# Altium project Pedal_XLR.PrjPcb (part 1 of 2)
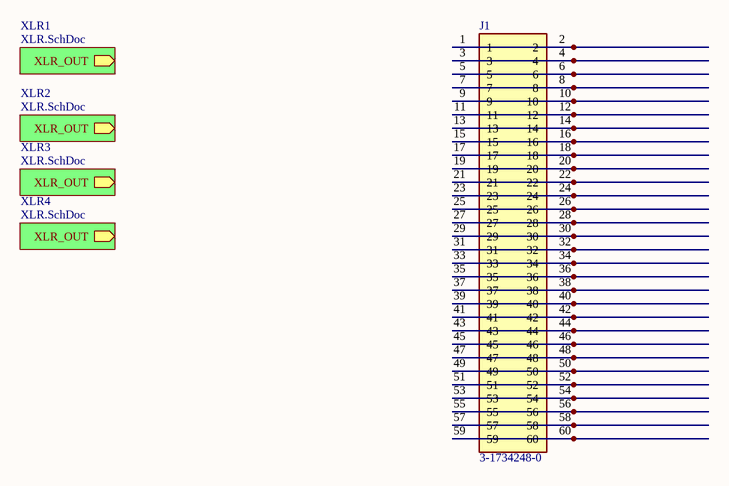
[diagram p0: Pedal_XLR.SchDoc]
3 sheets, 328 parts. Net scope: hierarchical (ports join the sheet entries above them; power ports are global).
Board file: Pedal_XLR.PcbDoc
Sheets:
  Pedal_XLR.SchDoc
    XLR1 = XLR.SchDoc
    XLR2 = XLR.SchDoc
    XLR3 = XLR.SchDoc
    XLR4 = XLR.SchDoc
  analog_tmp.SchDoc

## Sheet Pedal_XLR.SchDoc
size A3; SheetNumber: 1; SheetTotal: 3

### Parts
J1  3-1734248-0  [317342480]

### Sub-sheets
XLR1 = XLR.SchDoc: XLR_OUT (out)
XLR2 = XLR.SchDoc: XLR_OUT (out)
XLR3 = XLR.SchDoc: XLR_OUT (out)
XLR4 = XLR.SchDoc: XLR_OUT (out)

### Nets
NetJ1_1: J1.1 J1.2
NetJ1_3: J1.3 J1.4
NetJ1_5: J1.5 J1.6
NetJ1_7: J1.7 J1.8
NetJ1_9: J1.9 J1.10
NetJ1_11: J1.11 J1.12
NetJ1_13: J1.13 J1.14
NetJ1_15: J1.15 J1.16
NetJ1_17: J1.17 J1.18
NetJ1_19: J1.19 J1.20
NetJ1_21: J1.21 J1.22
NetJ1_23: J1.23 J1.24
NetJ1_25: J1.25 J1.26
NetJ1_27: J1.27 J1.28
NetJ1_29: J1.29 J1.30
NetJ1_31: J1.31 J1.32
NetJ1_33: J1.33 J1.34
NetJ1_35: J1.35 J1.36
NetJ1_37: J1.37 J1.38
NetJ1_39: J1.39 J1.40
NetJ1_41: J1.41 J1.42
NetJ1_43: J1.43 J1.44
NetJ1_45: J1.45 J1.46
NetJ1_47: J1.47 J1.48
NetJ1_49: J1.49 J1.50
NetJ1_51: J1.51 J1.52
NetJ1_53: J1.53 J1.54
NetJ1_55: J1.55 J1.56
NetJ1_57: J1.57 J1.58
NetJ1_59: J1.59 J1.60

### Library data of the parts
J1 = 3-1734248-0: Connector; Manufacturer_Name: TE Connectivity; Datasheet Link: https://www.te.com/commerce/DocumentDelivery/DDEController?Action=srchrtrv&DocNm=5-1773461-0_Standard_FPC_Connectors_QRG&DocType=Data%20Sheet&DocLang=English&PartCntxt=3-1734248-0&DocFormat=pdf; Height: 7.7mm; Manufacturer_Part_Number: 3-1734248-0; Mouser Part Number: 571-3-1734248-0; Mouser Price/Stock: https://www.mouser.co.uk/ProductDetail/TE-Connectivity/3-1734248-0?qs=rVE9j%252BL6g1a4TQRjUuGYiA%3D%3D; Arrow Part Number: 3-1734248-0; Arrow Price/Stock: https://www.arrow.com/en/products/3-1734248-0/te-connectivity; System: Connector

## Sheet XLR.SchDoc
size A4; SheetNumber: 2; SheetTotal: 3
Used 4 times, as channels XLR1, XLR2, XLR3, XLR4. Parts and nets are listed once, with the designators drawn on the sheet.
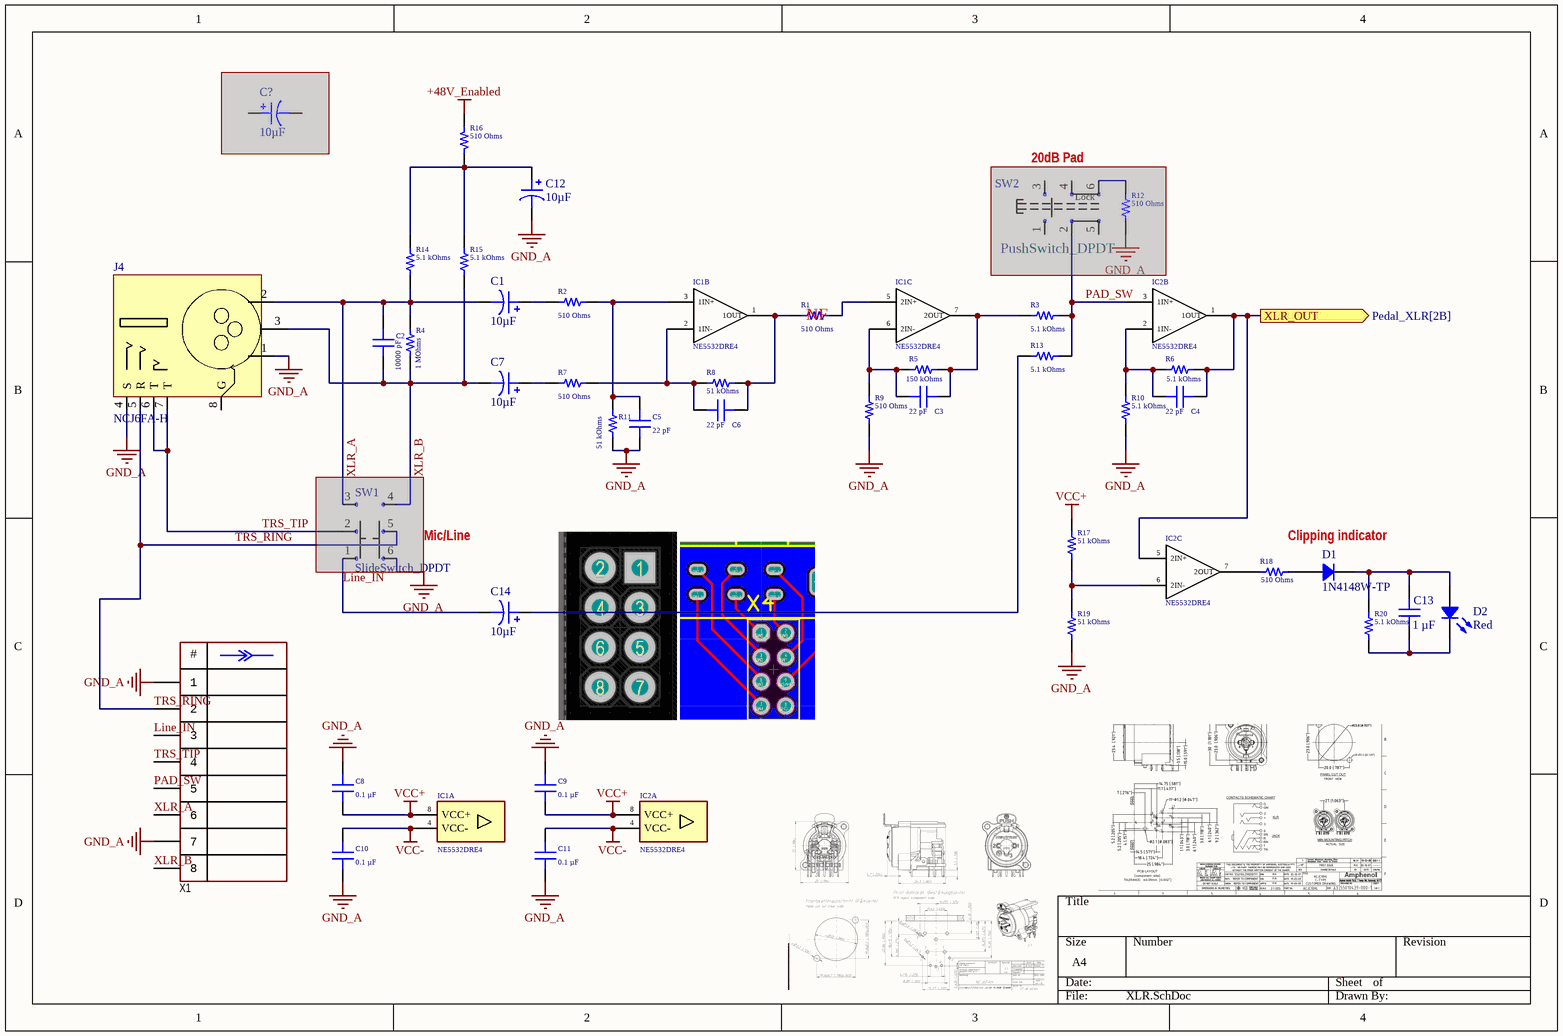
[diagram p1: XLR.SchDoc]

### Parts
C1  10µF  [CAP POL 1206_3216]
C2  10000 pF  [MURATA GRM188 0603_1608]
C3  22 pF  [CAP 0603_1608]
C4  22 pF  [CAP 0603_1608]
C5  22 pF  [CAP 0603_1608]
C6  22 pF  [CAP 0603_1608]
C7  10µF  [CAP POL 1206_3216]
C8  0.1 µF  [CAP 0603_1608]
C9  0.1 µF  [CAP 0603_1608]
C10  0.1 µF  [CAP 0603_1608]
C11  0.1 µF  [CAP 0603_1608]
C12  10µF  [CAP POL 1206_3216]
C13  1 µF  [CAP 0805_2012]
C14  10µF  [CAP POL 1206_3216]
C?  10µF  [CAP TH ALUM ELEC D4.00mm S1.50mm H6.00mm]  (masked out: inside a compile mask, not in the netlist)
D1  1N4148W-TP  [SOD-123]
D2  Red  [LED 0805_2012 RED]
IC1  NE5532DRE4  [SOIC127P600X175-8N]  (parts A,B,C of 3)
IC2  NE5532DRE4  [SOIC127P600X175-8N]  (parts A,B,C of 3)
J4  NCJ6FA-H  [NCJ6FA-H]
R1  510 Ohms  [YAGEO RES 0603_1608]
R2  510 Ohms  [YAGEO RES 0603_1608]
R3  5.1 kOhms  [YAGEO RES 0603_1608]
R4  value 1 MOhms  [RES 0603_1608]
R5  150 kOhms  [YAGEO RES 0603_1608]
R6  5.1 kOhms  [YAGEO RES 0603_1608]
R7  510 Ohms  [YAGEO RES 0603_1608]
R8  51 kOhms  [YAGEO RES 0603_1608]
R9  510 Ohms  [YAGEO RES 0603_1608]
R10  5.1 kOhms  [YAGEO RES 0603_1608]
R11  51 kOhms  [YAGEO RES 0603_1608]
R12  510 Ohms  [YAGEO RES 0603_1608]  (masked out: inside a compile mask, not in the netlist)
R13  5.1 kOhms  [YAGEO RES 0603_1608]
R14  5.1 kOhms  [YAGEO RES 0603_1608]
R15  5.1 kOhms  [YAGEO RES 0603_1608]
R16  510 Ohms  [YAGEO RES 0603_1608]
R17  51 kOhms  [YAGEO RES 0603_1608]
R18  510 Ohms  [YAGEO RES 0603_1608]
R19  51 kOhms  [YAGEO RES 0603_1608]
R20  5.1 kOhms  [YAGEO RES 0603_1608]
SW1  SlideSwitch_DPDT  [SK-22F03-G060]  (masked out: inside a compile mask, not in the netlist)
SW2  PushSwitch_DPDT  [TK-6580A-1]  (masked out: inside a compile mask, not in the netlist)
X1  (no value)  [CON: PLD-8]

### Ports
XLR_OUT (out, see Pedal_XLR[2B])

### Nets
+48V_Enabled: R16.2
GND_A: C5.1 C8.2 C9.2 C10.1 C11.1 C12.2 J4.1 J4.4(S) R9.1 R10.1 R11.1 R19.2 X1.1 X1.7
VCC+: C8.1 C9.1 IC1.8(VCC+) IC2.8(VCC+) R17.1
VCC-: C10.2 C11.2 IC1.4(VCC-) IC2.4(VCC-)
Line_IN: C14.2 X1.3
PAD_SW: IC2.3(1IN+) R3.2 R13.2 X1.5
TRS_RING: J4.5(R) X1.2
TRS_TIP: J4.6(T) J4.7(T) X1.4
XLR_A: C1.2 C2.2 J4.2 R4.1 R14.1 X1.6
XLR_B: C2.1 C7.2 J4.3 R4.2 R15.1 X1.8
XLR_OUT: C4.1 IC2.1(1OUT) IC2.5(2IN+) R6.2 ; port XLR_OUT
NetC1_1: C1.1 R2.1
NetC3_1: C3.1 IC1.7(2OUT) R3.1 R5.2
NetC3_2: C3.2 IC1.6(2IN-) R5.1 R9.2
NetC4_2: C4.2 IC2.2(1IN-) R6.1 R10.2
NetC5_2: C5.2 IC1.3(1IN+) R2.2 R11.2
NetC6_1: C6.1 IC1.1(1OUT) R1.1 R8.1
NetC6_2: C6.2 IC1.2(1IN-) R7.2 R8.2
NetC7_1: C7.1 R7.1
NetC12_1: C12.1 R14.2 R15.2 R16.1
NetC13_1: C13.1 D2.2 R20.1
NetC13_2: C13.2 D1.2 D2.1 R20.2
NetC14_1: C14.1 R13.1
NetD1_1: D1.1 R18.2
NetIC1_5: IC1.5(2IN+) R1.2
NetIC2_6: IC2.6(2IN-) R17.2 R19.1
NetIC2_7: IC2.7(2OUT) R18.1

Not connected (* = marked no-connect by the designer): J4 8(G)

### Channels
XLR1: designators end in _XLR1; ports XLR_OUT=NetC4_XLR1_1
XLR2: designators end in _XLR2; ports XLR_OUT=NetC4_XLR2_1
XLR3: designators end in _XLR3; ports XLR_OUT=NetC4_XLR3_1
XLR4: designators end in _XLR4; ports XLR_OUT=NetC4_XLR4_1

### Notes on the sheet
- (near SW2) 20dB Pad
- (near R1) NF
- (near SW1) Mic/Line
- Clipping indicator
- (in symbol PLD-8) #
- (in symbol PushSwitch_DPDT) Lock

### Library data of the parts
C1 C7 C12 C14 = T491A106K010AT: CAP TANT 10UF 10% 10V 1206; Manufacturer: KEMET; Manufacturer Size Code: A; ESR (Equivalent Series Resistance): 3.8Ohm; Lifetime @ Temp.: 2000 Hrs @ 125°C; Type: Molded; Part Number: T491A106K010AT; Value: 10µF; Capacitance: 10µF; ComponentLink1Description: Datasheet; ComponentLink1URL: https://api.kemet.com/component-edge/download/datasheet/T491A106K010AT.pdf; ComponentLink2Description: DigiKey Link; ComponentLink2URL: http://digikey.com/product-detail/en/kemet/T491A106K010AT/399-3684-1-ND/819009; Device Package: 1206 (3216 Metric); Features: General Purpose; Height - Seated (Max): 0.071" (1.80mm); LastUpdated: 9/2/2020 1:15:58 AM; Lifecycle Status: Active; Minimum Order: 1; Mounting Type: Surface Mount; Operating Temperature: -55°C ~ 125°C; Package / Case: 1206 (3216 Metric); Packaging: TapeAndReel; PartId: 330; Part Status: Active; Price: 0.07; Series: T491; Size / Dimension: 0.126" L x 0.063" W (3.20mm x 1.60mm); Supplier 1: DigiKey; Supplier Part Number 1: 399-3684-1-ND; Tolerance: ±10%; Voltage - Rated: 10V
C2 = GRM1885C1H103JA01D: CAP CER 10000PF 50V C0G/NP0 0603; manufacturer: Murata Electronics; Temperature Coefficient: C0G, NP0; Tolerance: ±5%; Part Number: GRM1885C1H103JA01D; Capacitance: 10000 pF; Applications: General Purpose; componentlink1description: Datasheet; componentlink1url: https://www.murata.com/~/media/webrenewal/support/library/catalog/products/capacitor/mlcc/c02e.ashx?la=en-us; componentlink2description: DigiKey Link; componentlink2url: https://www.digikey.com/en/products/detail/murata-electronics/GRM1885C1H103JA01D/4421555; Device Package: 0603 (1608 Metric); lastupdated: 7/20/2024 12:23:21 AM; Lifecycle Status: Active; Minimum Order: 1; Mounting Type: Surface Mount, MLCC; Operating Temperature: -55°C ~ 125°C; Package / Case: 0603 (1608 Metric); packaging: TapeAndReel; partid: 11077; Part Status: Active; price: 0.02; series: GRM; Size / Dimension: 0.063" L x 0.031" W (1.60mm x 0.80mm); Supplier 1: DigiKey; Supplier Part Number 1: 490-9666-1-ND; Thickness (Max): 0.035" (0.90mm); value: 10000 pF; Voltage - Rated: 50V
C3-C6 = CC0603GRNPO9BN220: CAP CER 22PF 50V C0G/NPO 0603; manufacturer: Yageo; Temperature Coefficient: C0G, NP0; Tolerance: ±2%; Part Number: CC0603GRNPO9BN220; Capacitance: 22 pF; Applications: General Purpose; componentlink1description: Datasheet; componentlink1url: https://www.yageo.com/upload/media/product/productsearch/datasheet/mlcc/UPY-GP_NP0_16V-to-50V_17.pdf; componentlink2description: DigiKey Link; componentlink2url: https://www.digikey.com/en/products/detail/yageo/CC0603GRNPO9BN220/5883550; Device Package: 0603 (1608 Metric); lastupdated: 2/9/2024 8:10:28 PM; Lifecycle Status: Active; Minimum Order: 1; Mounting Type: Surface Mount, MLCC; Operating Temperature: -55°C ~ 125°C; Package / Case: 0603 (1608 Metric); packaging: TapeAndReel; partid: 3677; Part Status: Active; price: 0.01; series: CC; Size / Dimension: 0.063" L x 0.031" W (1.60mm x 0.80mm); Supplier 1: DigiKey; Supplier Part Number 1: 311-3925-1-ND; Thickness (Max): 0.035" (0.90mm); value: 22 pF; Voltage - Rated: 50V
C8-C11 = C0603C104K5RAC7411: CAP CER 0.1UF 50V X7R 0603; manufacturer: KEMET; Tolerance: ±10%; Part Number: C0603C104K5RAC7411; Value: 0.1 µF; Applications: Bypass, Decoupling; Capacitance: 0.1 µF; componentlink1description: Datasheet; componentlink1url: https://api.kemet.com/component-edge/download/datasheet/C0603C104K5RAC7411.pdf; componentlink2description: DigiKey Link; componentlink2url: https://www.digikey.com/en/products/detail/kemet/C0603C104K5RAC7411/3317013; Device Package: 0603 (1608 Metric); lastupdated: 2/9/2024 8:10:30 PM; Lifecycle Status: Active; Minimum Order: 1; Mounting Type: Surface Mount, MLCC; Operating Temperature: -55°C ~ 125°C; Package / Case: 0603 (1608 Metric); packaging: TapeAndReel; partid: 2233; Part Status: Active; price: 0.01; series: SMD Comm X7R; Size / Dimension: 0.063" L x 0.031" W (1.60mm x 0.80mm); Supplier 1: DigiKey; Supplier Part Number 1: 399-C0603C104K5RAC7411CT-ND; Temperature Coefficient: X7R; Thickness (Max): 0.035" (0.90mm); Voltage - Rated: 50V
C13 = C0805C105K4RAC7800: CAP CER 1UF 16V X7R 0805; manufacturer: KEMET; Tolerance: ±10%; Part Number: C0805C105K4RAC7800; Value: 1 µF; Applications: Bypass, Decoupling; Capacitance: 1 µF; componentlink1description: Datasheet; componentlink1url: https://api.kemet.com/component-edge/download/datasheet/C0805C105K4RACTU.pdf; componentlink2description: DigiKey Link; componentlink2url: https://www.digikey.com/en/products/detail/kemet/C0805C105K4RAC7800/416047; Device Package: 0805 (2012 Metric); lastupdated: 9/19/2022 1:03:30 PM; Lifecycle Status: Active; Minimum Order: 1; Mounting Type: Surface Mount, MLCC; Operating Temperature: -55°C ~ 125°C; Package / Case: 0805 (2012 Metric); packaging: TapeAndReel; partid: 32075; Part Status: Active; price: 0.01; series: SMD Comm X7R; Size / Dimension: 0.079" L x 0.049" W (2.00mm x 1.25mm); Supplier 1: DigiKey; Supplier Part Number 1: 399-C0805C105K4RAC7800CT-ND; Temperature Coefficient: X7R; Thickness (Max): 0.039" (1.00mm); Voltage - Rated: 16V
C? = UMT1C100MDD1TP: CAP ALUM 10UF 20% 16V RADIAL; manufacturer: Nichicon; Lifetime @ Temp.: 1000 Hrs @ 105°C; Polarization: Polar; Ripple Current @ High Frequency: 27mA @ 10kHz; Ripple Current @ Low Frequency: 18mA @ 120Hz; Part Number: UMT1C100MDD1TP; Applications: General Purpose; Capacitance: 10µF; componentlink1description: Datasheet; componentlink1url: http://nichicon-us.com/english/products/pdfs/e-umt.pdf; componentlink2description: DigiKey Link; componentlink2url: http://digikey.com/product-detail/en/nichicon/UMT1C100MDD1TP/493-10276-1-ND/4312535; Device Package: Radial, Can; Height - Seated (Max): 0.236" (6.00mm); lastupdated: 9/6/2020 1:48:30 AM; Lead Spacing: 0.059" (1.50mm); Lifecycle Status: Active; Minimum Order: 1; Mounting Type: Through Hole; Operating Temperature: -55°C ~ 105°C; Package / Case: Radial, Can; packaging: TapeAndBox; partid: 23165; Part Status: Active; price: 0.05; series: UMT; Size / Dimension: 0.157" Dia (4.00mm); Supplier 1: DigiKey; Supplier Part Number 1: 493-10276-1-ND; Tolerance: ±20%; value: 10µF; Voltage - Rated: 16V
D1 = 1N4148W-TP: DIODE GEN PURP 100V 150MA SOD123; Manufacturer: Micro Commercial Co; Capacitance @ Vr, F: 2pF @ 0V, 1MHz; Current - Reverse Leakage @ Vr: 1 µA @ 75 V; Diode Type: Standard; Reverse Recovery Time (trr): 4 ns; Speed: Small Signal =< 200mA (Io), Any Speed; Voltage - Forward (Vf) (Max) @ If: 1.25 V @ 150 mA; Part Number: 1N4148W-TP; ComponentLink1Description: Datasheet; ComponentLink1URL: https://www.mccsemi.com/pdf/Products/1N4148W(SOD123).pdf; ComponentLink2Description: DigiKey Link; ComponentLink2URL: https://www.digikey.com/en/products/detail/micro-commercial-co/1N4148W-TP/717196; Current - Average Rectified (Io): 150mA; LastUpdated: 6/3/2024 7:54:46 PM; Lifecycle Status: Active; Minimum Order: 1; Mounting Type: Surface Mount; Operating Temperature - Junction: -65°C ~ 150°C; Package / Case: SOD-123; Packaging: TapeAndReel; PartId: 999; Part Status: Active; Price: 0.01; Series: -; Supplier 1: DigiKey; Supplier Part Number 1: 1N4148WTPMSCT-ND; Supplier Device Package: SOD-123; Voltage - DC Reverse (Vr) (Max): 100 V
D2 = LSM0805412V: LED RED CLEAR 0805 SMD; Manufacturer: Visual Communications Company - VCC; Configuration: 0805; Current - Test: 20mA; Lens Color: Colorless; Lens Size: 1.40mm x 1.20mm; Lens Style: Rectangle with Flat Top; Millicandela Rating: 100mcd; Viewing Angle: 120°; Voltage - Forward (Vf) (Typ): 2V; Wavelength - Dominant: 625nm; Part Number: LSM0805412V; Color: Red; ComponentLink1Description: Datasheet; ComponentLink1URL: https://www.vcclite.com/wp-content/uploads/wpallimport/files/files/LSM0805452V-Green-Datasheet.pdf; ComponentLink2Description: DigiKey Link; ComponentLink2URL: https://www.digikey.com/en/products/detail/visual-communications-company-vcc/LSM0805412V/10229616; Device Package: 0805 (2012 Metric); Height (Max): 0.90mm; LastUpdated: 6/3/2024 8:00:06 PM; Lens Transparency: Clear; Lifecycle Status: Active; Minimum Order: 1; Mounting Type: Surface Mount; Package / Case: 0805 (2012 Metric); Packaging: TapeAndReel; PartId: 336; Part Status: Active; Price: 0.11; Series: LSM0805; Size / Dimension: 2.00mm L x 1.25mm W; Supplier 1: DigiKey; Supplier Part Number 1: 28-LSM0805412VCT-ND; Supplier Device Package: 0805; Value: Red; Wavelength - Peak: 625nm
IC1 IC2 = NE5532DRE4: Integrated Circuit; Manufacturer_Name: Texas Instruments; Datasheet Link: https://www.ti.com/lit/ds/symlink/ne5532.pdf?HQS=dis-mous-null-mousermode-dsf-pf-null-wwe&ts=1618482303902&ref_url=https%253A%252F%252Fwww.mouser.com%252F; Height: 1.75mm; Manufacturer_Part_Number: NE5532DRE4; Mouser Part Number: 595-NE5532DRE4; Mouser Price/Stock: https://www.mouser.co.uk/ProductDetail/Texas-Instruments/NE5532DRE4?qs=7nS3%252BbEUL6spPf9Rt7S6cg%3D%3D; Arrow Part Number: NE5532DRE4; Arrow Price/Stock: https://www.arrow.com/en/products/ne5532dre4/texas-instruments
J4 = NCJ6FA-H: XLR Neutrik NCJ6FA-H
R1 R2 R7 R9 R12 R16 R18 = AC0603FR-07510RL: RES SMD 510 OHM 1% 1/10W 0603; Manufacturer: Yageo; Power (Watts): 0.1W, 1/10W; Temperature Coefficient: ±100ppm/°C; Part Number: AC0603FR-07510RL; Value: 510 Ohms; ComponentLink1Description: Datasheet; ComponentLink1URL: https://www.yageo.com/upload/media/product/productsearch/datasheet/rchip/PYu-AC_51_RoHS_L_7.pdf; ComponentLink2Description: DigiKey Link; ComponentLink2URL: https://www.digikey.com/en/products/detail/yageo/AC0603FR-07510RL/5896175; Composition: Thick Film; Device Package: 0603 (1608 Metric); Features: Automotive AEC-Q200, Moisture Resistant; Height - Seated (Max): 0.022" (0.55mm); LastUpdated: 7/25/2024 9:19:25 AM; Lifecycle Status: Active; Minimum Order: 1; Number of Terminations: 2; Operating Temperature: -55°C ~ 155°C; Package / Case: 0603 (1608 Metric); Packaging: CutTape; PartId: 15979; Part Status: Active; Price: 0.01; Ratings: AEC-Q200; Resistance: 510 Ohms; Series: AC; Size / Dimension: 0.063" L x 0.031" W (1.60mm x 0.80mm); Supplier 1: DigiKey; Supplier Part Number 1: YAG3615CT-ND; Supplier Device Package: 0603; Tolerance: ±1%
R3 R6 R10 R13-R15 R20 = AC0603FR-075K1L: RES SMD 5.1K OHM 1% 1/10W 0603; Manufacturer: Yageo; Power (Watts): 0.1W, 1/10W; Temperature Coefficient: ±100ppm/°C; Part Number: AC0603FR-075K1L; Value: 5.1 kOhms; ComponentLink1Description: Datasheet; ComponentLink1URL: https://www.yageo.com/upload/media/product/productsearch/datasheet/rchip/PYu-AC_51_RoHS_L_7.pdf; ComponentLink2Description: DigiKey Link; ComponentLink2URL: https://www.digikey.com/en/products/detail/yageo/AC0603FR-075K1L/5896209; Composition: Thick Film; Device Package: 0603 (1608 Metric); Features: Automotive AEC-Q200, Moisture Resistant; Height - Seated (Max): 0.022" (0.55mm); LastUpdated: 7/25/2024 9:19:23 AM; Lifecycle Status: Active; Minimum Order: 1; Number of Terminations: 2; Operating Temperature: -55°C ~ 155°C; Package / Case: 0603 (1608 Metric); Packaging: CutTape; PartId: 17442; Part Status: Active; Price: 0.01; Ratings: AEC-Q200; Resistance: 5.1 kOhms; Series: AC; Size / Dimension: 0.063" L x 0.031" W (1.60mm x 0.80mm); Supplier 1: DigiKey; Supplier Part Number 1: YAG3621CT-ND; Supplier Device Package: 0603; Tolerance: ±1%
R4 = ERJ-3EKF1004V: RES SMD 1M OHM 1% 1/10W 0603; Manufacturer: Panasonic Electronic Components; Power (Watts): 0.1W, 1/10W; Temperature Coefficient: ±100ppm/°C; Part Number: ERJ-3EKF1004V; ComponentLink1Description: Datasheet; ComponentLink1URL: https://industrial.panasonic.com/cdbs/www-data/pdf/RDA0000/AOA0000C304.pdf; ComponentLink2Description: DigiKey Link; ComponentLink2URL: https://www.digikey.com/en/products/detail/panasonic-electronic-components/ERJ-3EKF1004V/196033; Composition: Thick Film; Device Package: 0603 (1608 Metric); Height - Seated (Max): 0.022" (0.55mm); LastUpdated: 2/9/2024 8:42:00 PM; Lifecycle Status: Active; Minimum Order: 1; Number of Terminations: 2; Operating Temperature: -55°C ~ 155°C; Package / Case: 0603 (1608 Metric); Packaging: TapeAndReel; PartId: 25691; Part Status: Active; Price: 0.01; Resistance: 1 MOhms; Series: ERJ-3EK; Size / Dimension: 0.063" L x 0.031" W (1.60mm x 0.80mm); Supplier 1: DigiKey; Supplier Part Number 1: P1.00MHCT-ND; Supplier Device Package: 0603; Tolerance: ±1%; Features: Automotive AEC-Q200; Ratings: AEC-Q200
R5 = AC0603FR-07150KL: RES SMD 150K OHM 1% 1/10W 0603; Manufacturer: Yageo; Power (Watts): 0.1W, 1/10W; Temperature Coefficient: ±100ppm/°C; Part Number: AC0603FR-07150KL; Value: 150 kOhms; ComponentLink1Description: Datasheet; ComponentLink1URL: https://www.yageo.com/upload/media/product/productsearch/datasheet/rchip/PYu-AC_51_RoHS_L_7.pdf; ComponentLink2Description: DigiKey Link; ComponentLink2URL: https://www.digikey.com/en/products/detail/yageo/AC0603FR-07150KL/5895795; Composition: Thick Film; Device Package: 0603 (1608 Metric); Features: Automotive AEC-Q200, Moisture Resistant; Height - Seated (Max): 0.022" (0.55mm); LastUpdated: 7/25/2024 9:19:23 AM; Lifecycle Status: Active; Minimum Order: 1; Number of Terminations: 2; Operating Temperature: -55°C ~ 155°C; Package / Case: 0603 (1608 Metric); Packaging: CutTape; PartId: 17374; Part Status: Active; Price: 0.01; Ratings: AEC-Q200; Resistance: 150 kOhms; Series: AC; Size / Dimension: 0.063" L x 0.031" W (1.60mm x 0.80mm); Supplier 1: DigiKey; Supplier Part Number 1: YAG3567CT-ND; Supplier Device Package: 0603; Tolerance: ±1%
R8 R11 R17 R19 = AC0603FR-0751KL: RES SMD 51K OHM 1% 1/10W 0603; Manufacturer: Yageo; Power (Watts): 0.1W, 1/10W; Temperature Coefficient: ±100ppm/°C; Part Number: AC0603FR-0751KL; Value: 51 kOhms; ComponentLink1Description: Datasheet; ComponentLink1URL: https://www.yageo.com/upload/media/product/productsearch/datasheet/rchip/PYu-AC_51_RoHS_L_7.pdf; ComponentLink2Description: DigiKey Link; ComponentLink2URL: https://www.digikey.com/en/products/detail/yageo/AC0603FR-0751KL/5896179; Composition: Thick Film; Device Package: 0603 (1608 Metric); Features: Automotive AEC-Q200, Moisture Resistant; Height - Seated (Max): 0.022" (0.55mm); LastUpdated: 7/25/2024 9:19:23 AM; Lifecycle Status: Active; Minimum Order: 1; Number of Terminations: 2; Operating Temperature: -55°C ~ 155°C; Package / Case: 0603 (1608 Metric); Packaging: CutTape; PartId: 17419; Part Status: Active; Price: 0.01; Ratings: AEC-Q200; Resistance: 51 kOhms; Series: AC; Size / Dimension: 0.063" L x 0.031" W (1.60mm x 0.80mm); Supplier 1: DigiKey; Supplier Part Number 1: YAG3616CT-ND; Supplier Device Package: 0603; Tolerance: ±1%
X1 = PLD-8: Manufacturer: Connfly; ValueManufacturerPartNumber: Connector, 8pin, 2.54mm, 500VAC, 3A; TypeConnector: Connector; VoltageMax: 500VAC; Pitch: 2.54mm; CurrentMax: 3A; Multichannel: 8pin; CommentText: "Разъем"; HelpURL: https://www.chipdip.ru/product/pld-8-ds1021-2x4; PartNumber: PLD-8